# Altium schematic sheet MCU.SchDoc: MCU
size A3; Organization: CU Boulder; DocumentNumber: 003; Revision: 1.1; SheetNumber: 3; SheetTotal: 8
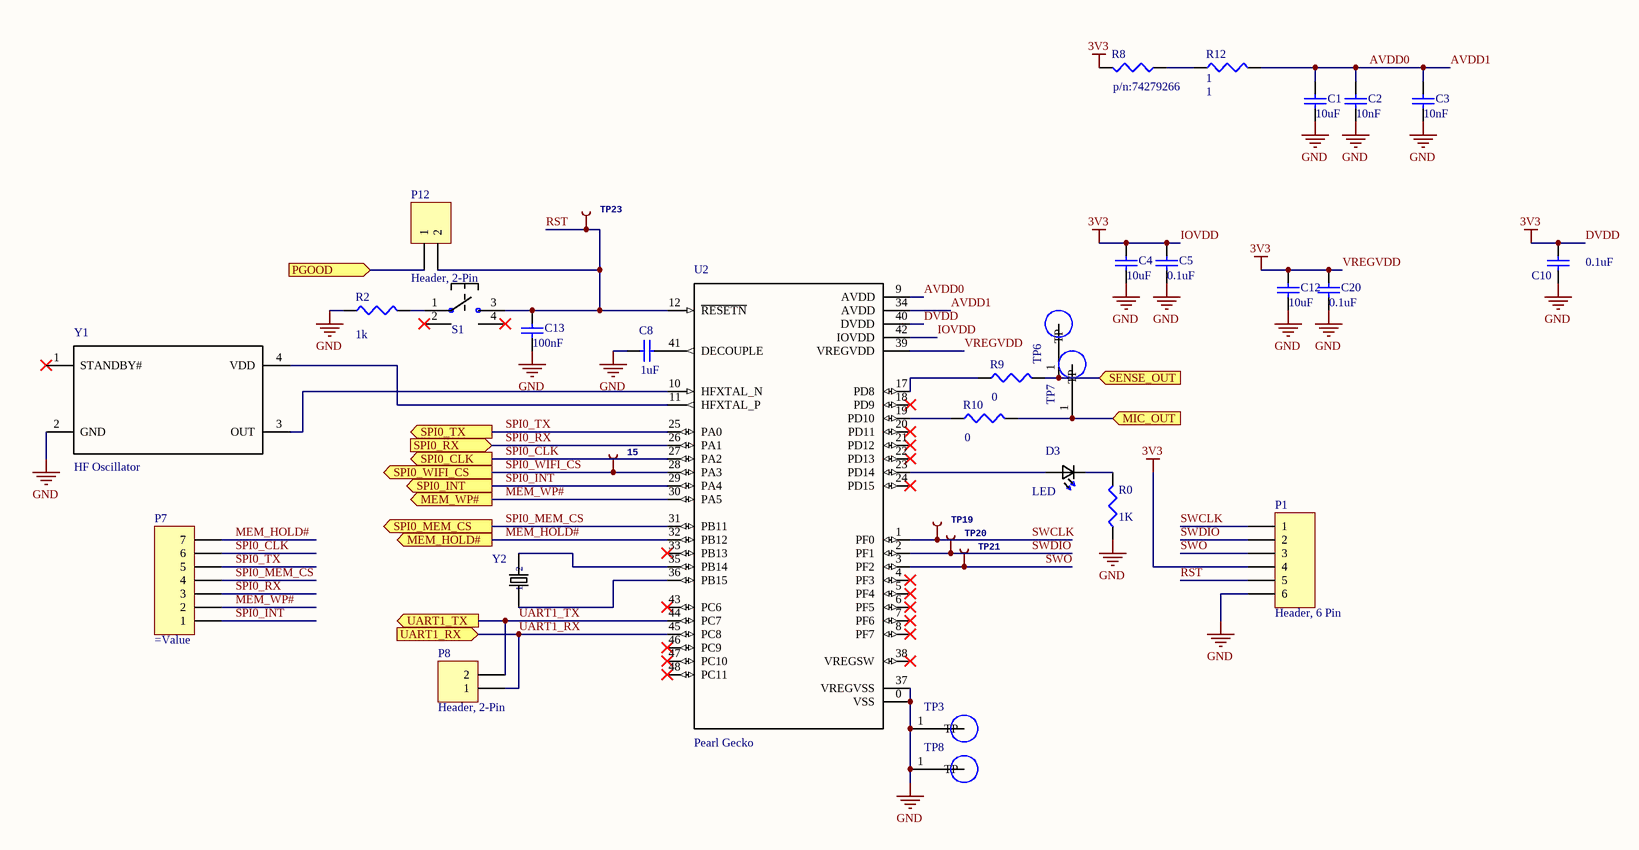
[diagram p0: MCU.SchDoc]

## Parts
15  SparkFun Test Points  [PAD.02X.02]  (value not drawn)
C1  10uF  [1608[0603]]
C2  10nF  [1608[0603]]
C3  10nF  [1608[0603]]
C4  10uF  [1608[0603]]
C5  0.1uF  [1608[0603]]
C8  1uF  [1608[0603]]
C10  0.1uF  [1608[0603]]
C12  10uF  [1608[0603]]
C13  100nF  [1608[0603]]
C20  0.1uF  [1608[0603]]
D3  LED  [0603_TLMO1100-GS08(Primary)]
P1  Header, 6 Pin  [HDR1X6]
P7  (no value)  [HDR1X7]
P8  Header, 2-Pin  [HDR1X2]
P12  Header, 2-Pin  [HDR1X2]
R0  1K  [J1-0603]
R2  1k  [J1-0603]
R8  value p/n:74279266  [J1-0603]  (hidden comment: Ferrite Bead)
R9  0  [J1-0603]
R10  0  [J1-0603]
R12  1  [J1-0603]
S1  Button  [TL3315NF100Q]  (value not drawn)
TP3  Test Points  [TP380X203]  (value not drawn)
TP6  Test Points  [TP380X203]  (value not drawn)
TP7  Test Points  [TP380X203]  (value not drawn)
TP8  Test Points  [TP380X203]  (value not drawn)
TP19  SparkFun Test Points  [PAD.02X.02]  (value not drawn)
TP20  SparkFun Test Points  [PAD.02X.02]  (value not drawn)
TP21  SparkFun Test Points  [PAD.02X.02]  (value not drawn)
TP23  SparkFun Test Points  [PAD.02X.02]  (value not drawn)
U2  Pearl Gecko  [QFN50P700X700X90-49N]
Y1  HF Oscillator  [OSCSC320X250X100N]
Y2  LF Oscillator  [XTAL320X150X90N]  (value not drawn)

## Ports
MEM_HOLD# (out), MEM_WP# (out), MIC_OUT (in), PGOOD (in), SENSE_OUT (in), SPI0_CLK (out), SPI0_INT (out), SPI0_MEM_CS (out), SPI0_RX (in), SPI0_TX (out), SPI0_WIFI_CS (out), UART1_RX (in), UART1_TX (out)

## Nets
DVDD: C4.2 C5.2 C10.2 C12.2 C20.2 P1.4 R8.2 U2.39(VREGVDD) U2.40(DVDD) U2.42(IOVDD)  [also labelled 3V3, IOVDD, VREGVDD]
GND: C1.1 C2.1 C3.1 C4.1 C5.1 C8.2 C10.1 C12.1 C13.1 C20.1 P1.6 R0.1 R2.1 TP3.1(TP) TP8.1(TP) U2.0(VSS) U2.37(VREGVSS) Y1.2(GND)
AVDD0: C1.2 C2.2 C3.2 R12.2 U2.9(AVDD) U2.34(AVDD)  [also labelled AVDD1]
MEM_HOLD#: P7.7 U2.32(PB12) ; port MEM_HOLD#
MEM_WP#: P7.2 U2.30(PA5) ; port MEM_WP#
MIC_OUT: R10.2 TP7.1(TP) ; port MIC_OUT
PGOOD: P12.1 ; port PGOOD
RST: C13.2 P1.5 P12.2 S1.3(P$2) TP23.P$1 U2.12(~{RESETN})
SENSE_OUT: R9.2 TP6.1(TP) ; port SENSE_OUT
SPI0_CLK: P7.6 U2.27(PA2) ; port SPI0_CLK
SPI0_INT: P7.1 U2.29(PA4) ; port SPI0_INT
SPI0_MEM_CS: P7.4 U2.31(PB11) ; port SPI0_MEM_CS
SPI0_RX: P7.3 U2.26(PA1) ; port SPI0_RX
SPI0_TX: P7.5 U2.25(PA0) ; port SPI0_TX
SPI0_WIFI_CS: 15.P$1 U2.28(PA3) ; port SPI0_WIFI_CS
SWCLK: P1.1 TP19.P$1 U2.1(PF0)
SWDIO: P1.2 TP20.P$1 U2.2(PF1)
SWO: P1.3 TP21.P$1 U2.3(PF2)
UART1_RX: P8.1 U2.45(PC8) ; port UART1_RX
UART1_TX: P8.2 U2.44(PC7) ; port UART1_TX
NetC8_1: C8.1 U2.41(DECOUPLE)
NetD3_1: D3.1(A2) U2.23(PD14)
NetD3_2: D3.2(K2) R0.2
NetR2_2: R2.2 S1.1(P$1)
NetR8_1: R8.1 R12.1
NetR9_1: R9.1 U2.17(PD8)
NetR10_1: R10.1 U2.19(PD10)
NetU2_10: U2.10(HFXTAL_N) Y1.3(OUT)
NetU2_11: U2.11(HFXTAL_P) Y1.4(VDD)
NetU2_35: U2.35(PB14) Y2.2
NetU2_36: U2.36(PB15) Y2.1

Not connected (* = marked no-connect by the designer): S1 2(P$1)* 4(P$2)*; U2 4(PF3)* 5(PF4)* 6(PF5)* 7(PF6)* 8(PF7)* 18(PD9)* 20(PD11)* 21(PD12)* 22(PD13)* 24(PD15)* 33(PB13)* 38(VREGSW)* 43(PC6)* 46(PC9)* 47(PC10)* 48(PC11)*; Y1 1(STANDBY#)*

## Notes on the sheet
- Title
- Size:
- Date:
- A3
- Number:
- Time:
- Revision:
- Sheet
- of
- File:

## Library data of the parts
15 TP19-TP21 TP23 = TEST-POINT2: Supplier 1: Digi-Key
  15 TP20 TP21: Supplier Part Number 1: 36-5019CT-ND
  TP19 TP23: Supplier Part Number 1: 36-5019DKR-ND
C1-C5 C8 C10 C13 C20 = Cap Semi: Capacitor (Semiconductor SIM Model); Published: 8-Jun-2000; LatestRevisionDate: 29-May-2009; LatestRevisionNote: IPC-7351 Footprint Added.; PackageReference: C1206; Publisher: Altium Limited; PackageDescription: Chip Capacitor; Supplier 1: Digi-Key
  C1: Value: 10uF; Supplier Part Number 1: 1276-1948-1-ND
  C2: Value: 10nF; Supplier Part Number 1: 311-1085-1-ND
  C3: Value: 10nF; Supplier Part Number 1: 311-1085-6-ND
  C4: Value: 10uF; Supplier Part Number 1: 1276-1948-6-ND
  C5 C10 C20: Value: 0.1uF; Supplier Part Number 1: 311-1088-6-ND
  C8: Value: 1uF; Supplier Part Number 1: 1276-1946-6-ND
  C13: Value: 100nF; Supplier Part Number 1: 311-1088-1-ND
C12 = Cap Semi: Capacitor (Semiconductor SIM Model); Manufacturer: Samsung; Manufacturer Part Number: CL10B106MQ8NRNC; Capacitance: 10 µF; Dielectric: X7R; Tolerance (%): ±20 %; Rated Voltage: 6.3 V; Published: 8-Jun-2000; LatestRevisionDate: 29-May-2009; LatestRevisionNote: IPC-7351 Footprint Added.; PackageReference: C1206; Publisher: Altium Limited; PackageDescription: Chip Capacitor; Value: 10uF; Supplier 1: Digi-Key; Supplier Part Number 1: 1276-1948-6-ND; Supplier 2: Digi-Key; Supplier Part Number 2: 1276-1948-1-ND; Stock 2: 193796; Pricing 2: 1=0.94, 10=0.715, 100=0.5115, 500=0.396, 1000=0.341 (USD); Case Size/Dimension: 0603; ComponentLink1URL: https://datasheet.ciiva.com/25723/cl10b106mq8nrnc-25723233.pdf; ComponentLink1Description: https://datasheet.ciiva.com/25723/cl10b106mq8nrnc-25723233.pdf; ComponentLink2URL: https://datasheet.ciiva.com/16428/cl10b106mq8nrnc-16428858.pdf; ComponentLink2Description: https://datasheet.ciiva.com/16428/cl10b106mq8nrnc-16428858.pdf
D3 = TLMO1100-GS08: Orange 0603 160Â° 80 mcd 2.1 V 30 mA Non Diffused Surface Mount LED; MF: Vishay; MP: TLMO1100-GS08; Digi-Key_Part_Number: 751-1174-1-ND; Package: 0603 Vishay; Digi-Key_Purchase_URL: https://www.digikey.com/product-detail/en/vishay-semiconductor-opto-division/TLMO1100-GS08/751-1174-1-ND/1681457?WT.z_cid=ref_snapeda; Value: *; Supplier 1: Digi-Key; Supplier Part Number 1: 751-1174-6-ND
P1 = Header 6: Header, 6-Pin; LatestRevisionDate: 17-Jul-2002; LatestRevisionNote: Re-released for DXP Platform.; Publisher: Altium Limited; Supplier 1: Digi-Key; Supplier Part Number 1: 732-5327-ND
P7 = Header 7: Header, 7-Pin; LatestRevisionDate: 17-Jul-2002; LatestRevisionNote: Re-released for DXP Platform.; Publisher: Altium Limited; Supplier 1: Digi-Key; Supplier Part Number 1: 732-5327-ND
P8 P12 = Header 2: LatestRevisionDate: 17-Jul-2002; LatestRevisionNote: Re-released for DXP Platform.; Publisher: Altium Limited; Supplier 1: Digi-Key; Supplier Part Number 1: 732-5327-ND
R0 R2 R8-R10 R12 = Res3: Resistor; Published: 8-Jun-2000; LatestRevisionDate: 29-May-2009; LatestRevisionNote: IPC-7351 Footprint Added.; PackageReference: J1-0603; Publisher: Altium Limited; PackageDescription: Chip Resistor; Supplier 1: Digi-Key
  R0: Value: 1K; Supplier Part Number 1: 311-0.0GRDKR-ND
  R2: Value: 1k; Supplier Part Number 1: 311-1.0KGRCT-ND
  R8: Supplier Part Number 1: 732-4484-1-ND
  R9 R10: Value: 0; Supplier Part Number 1: 311-0.0GRDKR-ND
  R12: Value: 1; Supplier Part Number 1: 311-1.00HRDKR-ND
S1 = TL3315NF100Q: TL3315 Series SPST 1 N Round Button J-Bend SMT Low Profile Tactile Switch; MF: E-Switch; Price: 0.13 USD; Package: None; Availability: Good; MP: TL3315NF100Q; Value: *
TP3 TP6-TP8 = 5019: Phosphor Bronze Contact Miniature Silver Plated Surface Mount Test Points; MF: Keystone; Digi-Key_Part_Number: 36-5019CT-ND; Digi-Key_Purchase_URL: https://www.digikey.com/product-detail/en/keystone-electronics/5019/36-5019CT-ND/3907344?WT.z_cid=ref_snapeda; MP: 5019; Package: None; Value: *; Supplier 1: Digi-Key
  TP3: Supplier Part Number 1: 36-5019CT-ND
  TP6-TP8: Supplier Part Number 1: 36-5019DKR-ND
U2 = EFM32PG12B500F1024GM48-B: MCU 32-bit ARM Cortex M4 RISC 1024KB Flash 3.3V 48-Pin QFN EP; MF: Silicon Labs; MP: EFM32PG12B500F1024GM48-B; Package: QFN-48 Silicon Labs; Price: 5.00 USD; Availability: Warning; Value: *; Supplier 1: Digi-Key; Supplier Part Number 1: 336-3941-ND
Y1 = ASFLMB-40.000MHZ-LR-T: Oscillator MEMS 40MHz ?25ppm (Stability) 15pF 55% 1.8V/2.5V/3.3V Automotive 4-Pin QFN SMD T/R; MF: Abracon; Availability: Good; Price: 1.39 USD; MP: ASFLMB-40.000MHZ-LR-T; Package: SMD-4 Abracon; Value: *; Supplier 1: Digi-Key; Supplier Part Number 1: 535-11000-1-ND
Y2 = ECS-.327-12.5-34B-TR: MF: ECS International; Package: SMD-2 ECS International; Digi-Key_Purchase_URL: https://www.digikey.com/product-detail/en/ecs-inc/ECS-.327-12.5-34B-TR/XC1617CT-ND/1693786?WT.z_cid=ref_snapeda; Digi-Key_Part_Number: XC1617CT-ND; MP: ECS-.327-12.5-34B-TR; Value: *; Supplier 1: Mouser; Supplier Part Number 1: 520-ECS-327-12.5-34B